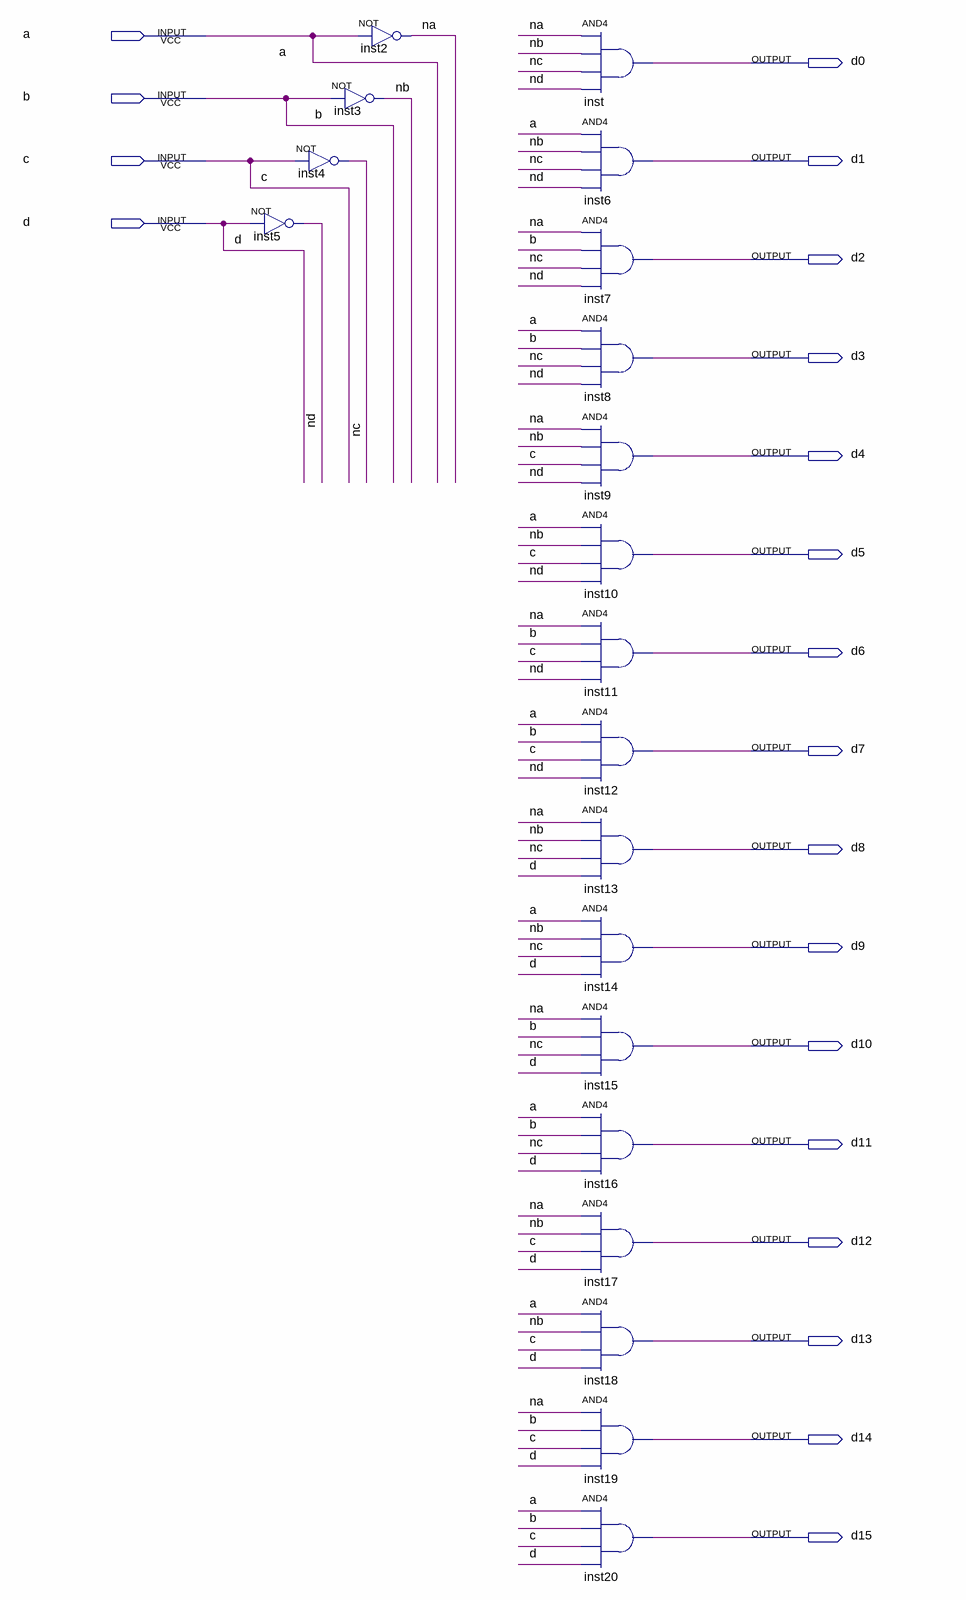
[diagram p0: schematic sheet]
// Quartus schematic decod4x16.bdf as structural Verilog: 20 symbols, 20 pins
module decod4x16 (
  input  a,
  input  b,
  input  c,
  input  d,
  output d0,
  output d1,
  output d2,
  output d3,
  output d4,
  output d5,
  output d6,
  output d7,
  output d8,
  output d9,
  output d10,
  output d11,
  output d12,
  output d13,
  output d14,
  output d15
);

  wire na, nb, nc, nd;

  not inst5 (nd, d);
  not inst3 (nb, b);
  not inst4 (nc, c);
  not inst2 (na, a);
  and inst (d0, na, nb, nc, nd);
  and inst6 (d1, a, nb, nc, nd);
  and inst7 (d2, na, b, nc, nd);
  and inst8 (d3, a, b, nc, nd);
  and inst9 (d4, na, nb, c, nd);
  and inst10 (d5, a, nb, c, nd);
  and inst11 (d6, na, b, c, nd);
  and inst12 (d7, a, b, c, nd);
  and inst13 (d8, na, nb, nc, d);
  and inst14 (d9, a, nb, nc, d);
  and inst15 (d10, na, b, nc, d);
  and inst16 (d11, a, b, nc, d);
  and inst17 (d12, na, nb, c, d);
  and inst18 (d13, a, nb, c, d);
  and inst19 (d14, na, b, c, d);
  and inst20 (d15, a, b, c, d);
endmodule
